# EAGLE design MCPv3ULN2803 (EAGLE 9.6.2)
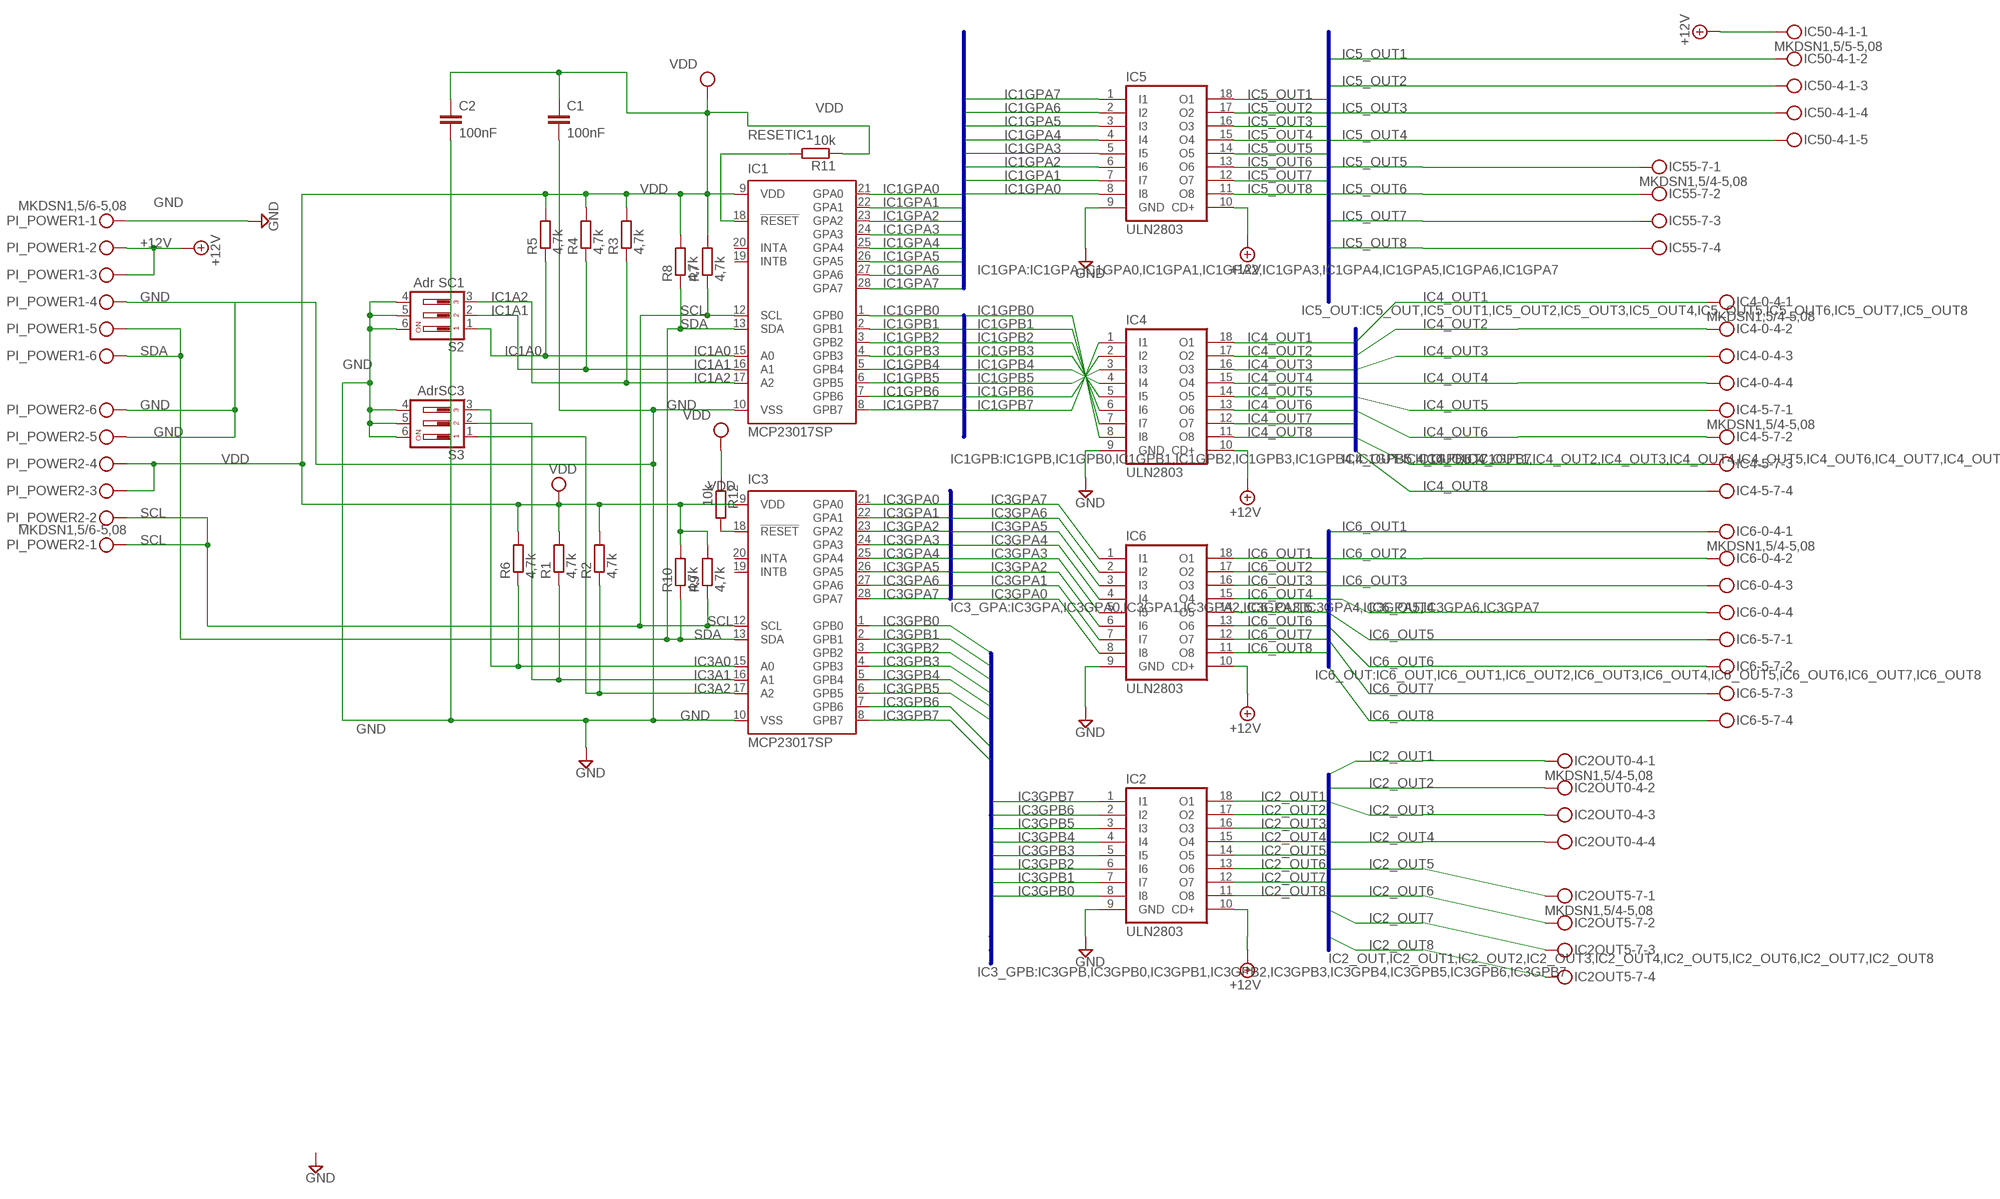
[diagram p0: schematic, sheet 1]

## Parts
C1  100nF  C-EU025_050-025X075  [C025_050-025X075]
C2  100nF  C-EU025_050-025X075  [C025_050-025X075]
IC1  MCP23017SP  [DIL28-3]
IC2  ULN2803  ULN2803A  [DIL18]
IC2OUT0-4  MKDSN1,5/4-5,08  [MKDSN1,5/4-5,08]
IC2OUT5-7  MKDSN1,5/4-5,08  [MKDSN1,5/4-5,08]
IC3  MCP23017SP  [DIL28-3]
IC4  ULN2803  ULN2803A  [DIL18]
IC4-0-4  MKDSN1,5/4-5,08  [MKDSN1,5/4-5,08]
IC4-5-7  MKDSN1,5/4-5,08  [MKDSN1,5/4-5,08]
IC5  ULN2803  ULN2803A  [DIL18]
IC6  ULN2803  ULN2803A  [DIL18]
IC6-0-4  MKDSN1,5/4-5,08  [MKDSN1,5/4-5,08]
IC6-5-7  MKDSN1,5/4-5,08  [MKDSN1,5/4-5,08]
IC50-4-1  MKDSN1,5/5-5,08  [MKDSN1,5/5-5,08]
IC55-7  MKDSN1,5/4-5,08  [MKDSN1,5/4-5,08]
PI_POWER1  MKDSN1,5/6-5,08  [MKDSN1,5/6-5,08]
PI_POWER2  MKDSN1,5/6-5,08  [MKDSN1,5/6-5,08]
R1  4,7k  R-EU_0204/7  [0204/7]
R2  4,7k  R-EU_0204/7  [0204/7]
R3  4,7k  R-EU_0204/7  [0204/7]
R4  4,7k  R-EU_0204/7  [0204/7]
R5  4,7k  R-EU_0204/7  [0204/7]
R6  4,7k  R-EU_0204/7  [0204/7]
R7  4,7k  R-EU_0204/7  [0204/7]
R8  4,7k  R-EU_0204/7  [0204/7]
R9  4,7k  R-EU_0204/7  [0204/7]
R10  4,7k  R-EU_0204/7  [0204/7]
R11  10k  R-EU_0204/7  [0204/7]
R12  10k  R-EU_0204/7  [0204/7]
S2  Adr SC1  DIP03YL  [DIP03YL]
S3  AdrSC3  DIP03YL  [DIP03YL]

## Nets
+12V: IC2.10(CD+) IC4.10(CD+) IC5.10(CD+) IC6.10(CD+) IC50-4-1.1 PI_POWER1.2 PI_POWER1.3
GND: C1.2 C2.2 IC1.10(VSS) IC2.9(GND) IC3.10(VSS) IC4.9(GND) IC5.9(GND) IC6.9(GND) PI_POWER1.1 PI_POWER1.4 PI_POWER2.5 PI_POWER2.6 S2.4 S2.5 S2.6 S3.4 S3.5 S3.6
IC1A0: IC1.15(A0) R5.1 S2.1
IC1A1: IC1.16(A1) R4.1 S2.2
IC1A2: IC1.17(A2) R3.1 S2.3
IC1GPA0: IC1.21(GPA0) IC5.8(I8)
IC1GPA1: IC1.22(GPA1) IC5.7(I7)
IC1GPA2: IC1.23(GPA2) IC5.6(I6)
IC1GPA3: IC1.24(GPA3) IC5.5(I5)
IC1GPA4: IC1.25(GPA4) IC5.4(I4)
IC1GPA5: IC1.26(GPA5) IC5.3(I3)
IC1GPA6: IC1.27(GPA6) IC5.2(I2)
IC1GPA7: IC1.28(GPA7) IC5.1(I1)
IC1GPB0: IC1.1(GPB0) IC4.8(I8)
IC1GPB1: IC1.2(GPB1) IC4.7(I7)
IC1GPB2: IC1.3(GPB2) IC4.6(I6)
IC1GPB3: IC1.4(GPB3) IC4.5(I5)
IC1GPB4: IC1.5(GPB4) IC4.4(I4)
IC1GPB5: IC1.6(GPB5) IC4.3(I3)
IC1GPB6: IC1.7(GPB6) IC4.2(I2)
IC1GPB7: IC1.8(GPB7) IC4.1(I1)
IC2_OUT1: IC2.18(O1) IC2OUT0-4.1
IC2_OUT2: IC2.17(O2) IC2OUT0-4.2
IC2_OUT3: IC2.16(O3) IC2OUT0-4.3
IC2_OUT4: IC2.15(O4) IC2OUT0-4.4
IC2_OUT5: IC2.14(O5) IC2OUT5-7.1
IC2_OUT6: IC2.13(O6) IC2OUT5-7.2
IC2_OUT7: IC2.12(O7) IC2OUT5-7.3
IC2_OUT8: IC2.11(O8) IC2OUT5-7.4
IC3A0: IC3.15(A0) R6.1 S3.3
IC3A1: IC3.16(A1) R1.1 S3.2
IC3A2: IC3.17(A2) R2.1 S3.1
IC3GPA0: IC3.21(GPA0) IC6.8(I8)
IC3GPA1: IC3.22(GPA1) IC6.7(I7)
IC3GPA2: IC3.23(GPA2) IC6.6(I6)
IC3GPA3: IC3.24(GPA3) IC6.5(I5)
IC3GPA4: IC3.25(GPA4) IC6.4(I4)
IC3GPA5: IC3.26(GPA5) IC6.3(I3)
IC3GPA6: IC3.27(GPA6) IC6.2(I2)
IC3GPA7: IC3.28(GPA7) IC6.1(I1)
IC3GPB0: IC2.8(I8) IC3.1(GPB0)
IC3GPB1: IC2.7(I7) IC3.2(GPB1)
IC3GPB2: IC2.6(I6) IC3.3(GPB2)
IC3GPB3: IC2.5(I5) IC3.4(GPB3)
IC3GPB4: IC2.4(I4) IC3.5(GPB4)
IC3GPB5: IC2.3(I3) IC3.6(GPB5)
IC3GPB6: IC2.2(I2) IC3.7(GPB6)
IC3GPB7: IC2.1(I1) IC3.8(GPB7)
IC4_OUT1: IC4-0-4.1 IC4.18(O1)
IC4_OUT2: IC4-0-4.2 IC4.17(O2)
IC4_OUT3: IC4-0-4.3 IC4.16(O3)
IC4_OUT4: IC4-0-4.4 IC4.15(O4)
IC4_OUT5: IC4-5-7.1 IC4.14(O5)
IC4_OUT6: IC4-5-7.2 IC4.13(O6)
IC4_OUT7: IC4-5-7.3 IC4.12(O7)
IC4_OUT8: IC4-5-7.4 IC4.11(O8)
IC5_OUT1: IC5.18(O1) IC50-4-1.2
IC5_OUT2: IC5.17(O2) IC50-4-1.3
IC5_OUT3: IC5.16(O3) IC50-4-1.4
IC5_OUT4: IC5.15(O4) IC50-4-1.5
IC5_OUT5: IC5.14(O5) IC55-7.1
IC5_OUT6: IC5.13(O6) IC55-7.2
IC5_OUT7: IC5.12(O7) IC55-7.3
IC5_OUT8: IC5.11(O8) IC55-7.4
IC6_OUT1: IC6-0-4.1 IC6.18(O1)
IC6_OUT2: IC6-0-4.2 IC6.17(O2)
IC6_OUT3: IC6-0-4.3 IC6.16(O3)
IC6_OUT4: IC6-0-4.4 IC6.15(O4)
IC6_OUT5: IC6-5-7.1 IC6.14(O5)
IC6_OUT6: IC6-5-7.2 IC6.13(O6)
IC6_OUT7: IC6-5-7.3 IC6.12(O7)
IC6_OUT8: IC6-5-7.4 IC6.11(O8)
RESETIC1: IC1.18(!RESET) R11.2
RESETIC3: IC3.18(!RESET) R12.2
SCL: IC1.12(SCL) IC3.12(SCL) PI_POWER2.1 PI_POWER2.2 R7.1 R9.1
SDA: IC1.13(SDA) IC3.13(SDA) PI_POWER1.5 PI_POWER1.6 R8.1 R10.1
VDD: C1.1 C2.1 IC1.9(VDD) IC3.9(VDD) PI_POWER2.3 PI_POWER2.4 R1.2 R2.2 R3.2 R4.2 R5.2 R6.2 R7.2 R8.2 R9.2 R10.2 R11.1 R12.1
Unconnected: IC1.19(INTB) IC1.20(INTA) IC3.19(INTB) IC3.20(INTA)

## Buses
IC1GPA:IC1GPA,IC1GPA0,IC1GPA1,IC1GPA2,IC1GPA3,IC1GPA4,IC1GPA5,IC1GPA6,IC1GPA7
IC5_OUT:IC5_OUT,IC5_OUT1,IC5_OUT2,IC5_OUT3,IC5_OUT4,IC5_OUT5,IC5_OUT6,IC5_OUT7,IC5_OUT8
IC1GPB:IC1GPB,IC1GPB0,IC1GPB1,IC1GPB2,IC1GPB3,IC1GPB4,IC1GPB5,IC1GPB6,IC1GPB7
IC4_OUT:IC4_OUT,IC4_OUT1,IC4_OUT2,IC4_OUT3,IC4_OUT4,IC4_OUT5,IC4_OUT6,IC4_OUT7,IC4_OUT8
IC3_GPA:IC3GPA,IC3GPA0,IC3GPA1,IC3GPA2,IC3GPA3,IC3GPA4,IC3GPA5,IC3GPA6,IC3GPA7
IC6_OUT:IC6_OUT,IC6_OUT1,IC6_OUT2,IC6_OUT3,IC6_OUT4,IC6_OUT5,IC6_OUT6,IC6_OUT7,IC6_OUT8
IC3_GPB:IC3GPB,IC3GPB0,IC3GPB1,IC3GPB2,IC3GPB3,IC3GPB4,IC3GPB5,IC3GPB6,IC3GPB7
IC2_OUT,IC2_OUT1,IC2_OUT2,IC2_OUT3,IC2_OUT4,IC2_OUT5,IC2_OUT6,IC2_OUT7,IC2_OUT8

## Library data of the parts
C1 C2 = resistor:C-EU: CAPACITOR, European symbol
IC1 IC3 = microchip:MCP23017: http://ww1.microchip.com/downloads/en/DeviceDoc/21952a.pdf Source: http://ww1.microchip.com/downloads/en/DeviceDoc/21952a.pdf; MF: MICROCHIP; MPN: MCP23017-E/SP; OC_FARNELL: 1332088; OC_NEWARK: 31K2959
IC2 IC4-IC6 = uln-udn:ULN2803A: DRIVER ARRAY
IC2OUT0-4 IC2OUT5-7 IC4-0-4 IC4-5-7 IC6-0-4 IC6-5-7 IC55-7 = con-phoenix-508:MKDSN1,5/4-5,08: MKDSN 1,5/ 4-5,08 Printklemme Nennstrom: 13,5 A Nennspannung: 250 V Rastermaß: 5,08 mm Polzahl: 4 Anschlussart: Schraubanschluss Montage: Löten Anschlussrichtung Leiter/Platine: 0 ° Artikelnummer: 1729144 Source: http://eshop.phoenixcontact.com .. 1729144.pdf
IC50-4-1 = con-phoenix-508:MKDSN1,5/5-5,08: MKDSN 1,5/ 5-5,08 Printklemme Nennstrom: 13,5 A Nennspannung: 250 V Rastermaß: 5,08 mm Polzahl: 5 Anschlussart: Schraubanschluss Montage: Löten Anschlussrichtung Leiter/Platine: 0 ° Artikelnummer: 1729157 Source: http://eshop.phoenixcontact.com .. 1729157.pdf
PI_POWER1 PI_POWER2 = con-phoenix-508:MKDSN1,5/6-5,08: MKDSN 1,5/ 6-5,08 Printklemme Nennstrom: 13,5 A Nennspannung: 250 V Rastermaß: 5,08 mm Polzahl: 6 Anschlussart: Schraubanschluss Montage: Löten Anschlussrichtung Leiter/Platine: 0 ° Artikelnummer: 1729160 Source: http://eshop.phoenixcontact.com .. 1729160.pdf
R1-R12 = resistor:R-EU_: RESISTOR, European symbol
S2 S3 = switch-dil:DIP03YL: DIL/CODE SWITCH; OC_FARNELL: unknown; OC_NEWARK: unknown

## Board
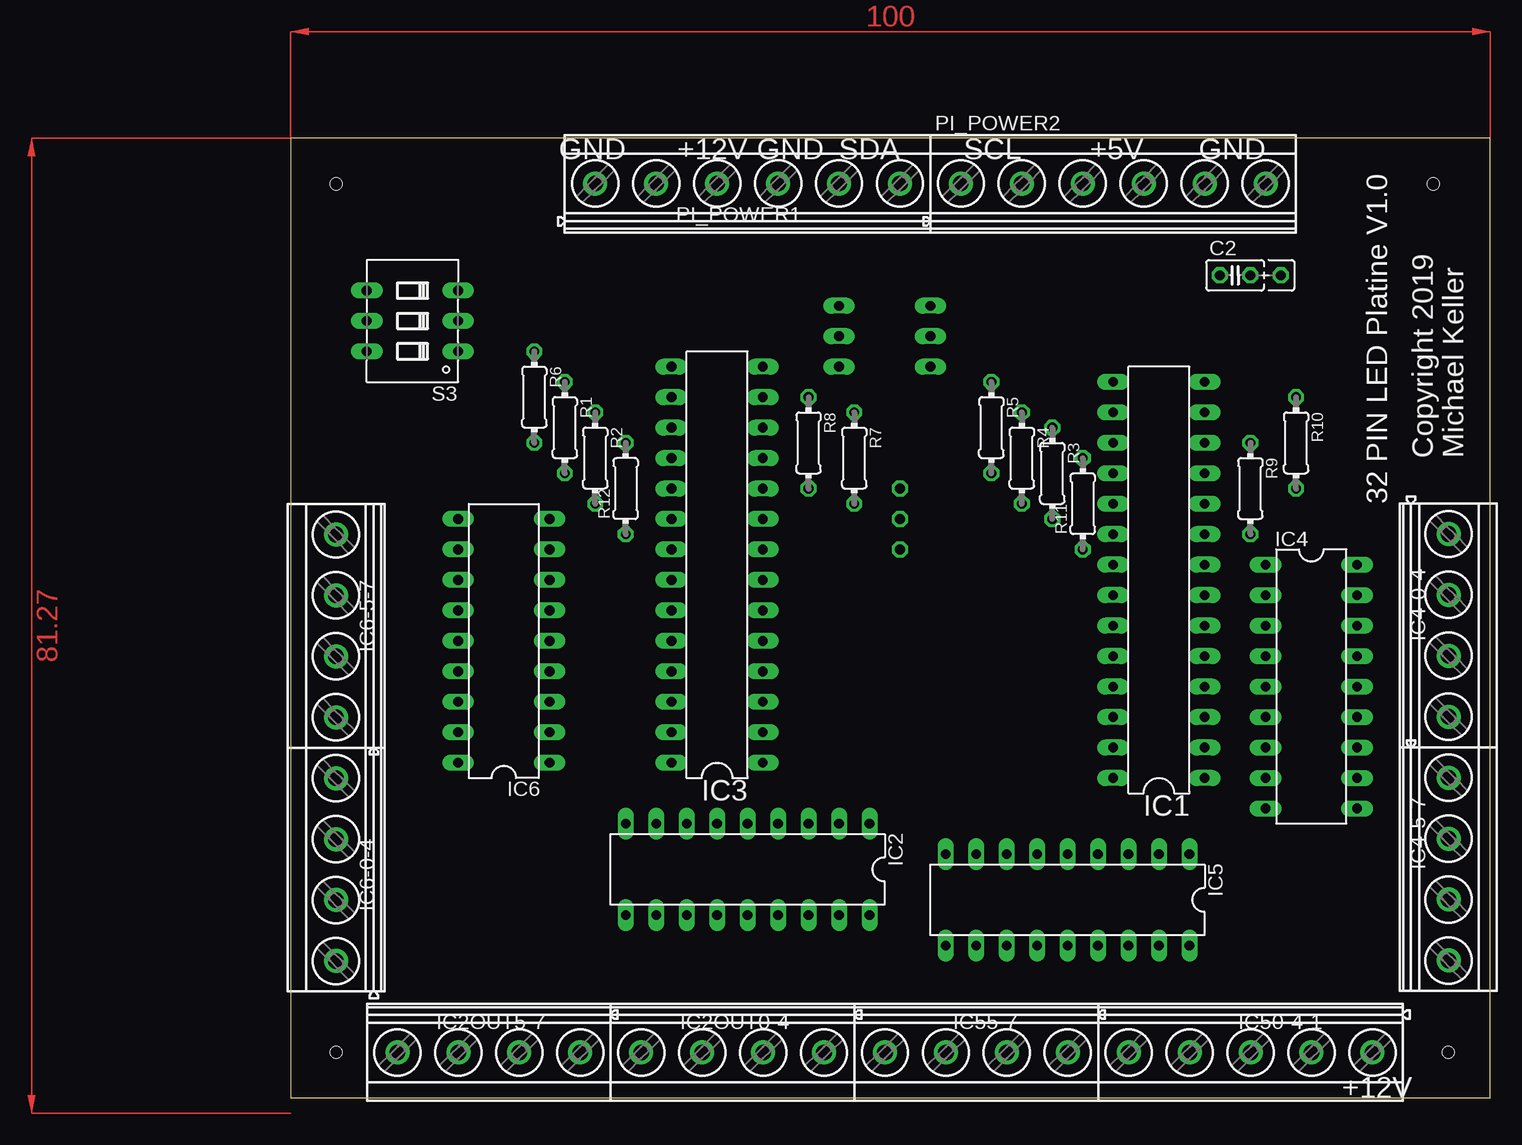
[diagram p1: board, top side]
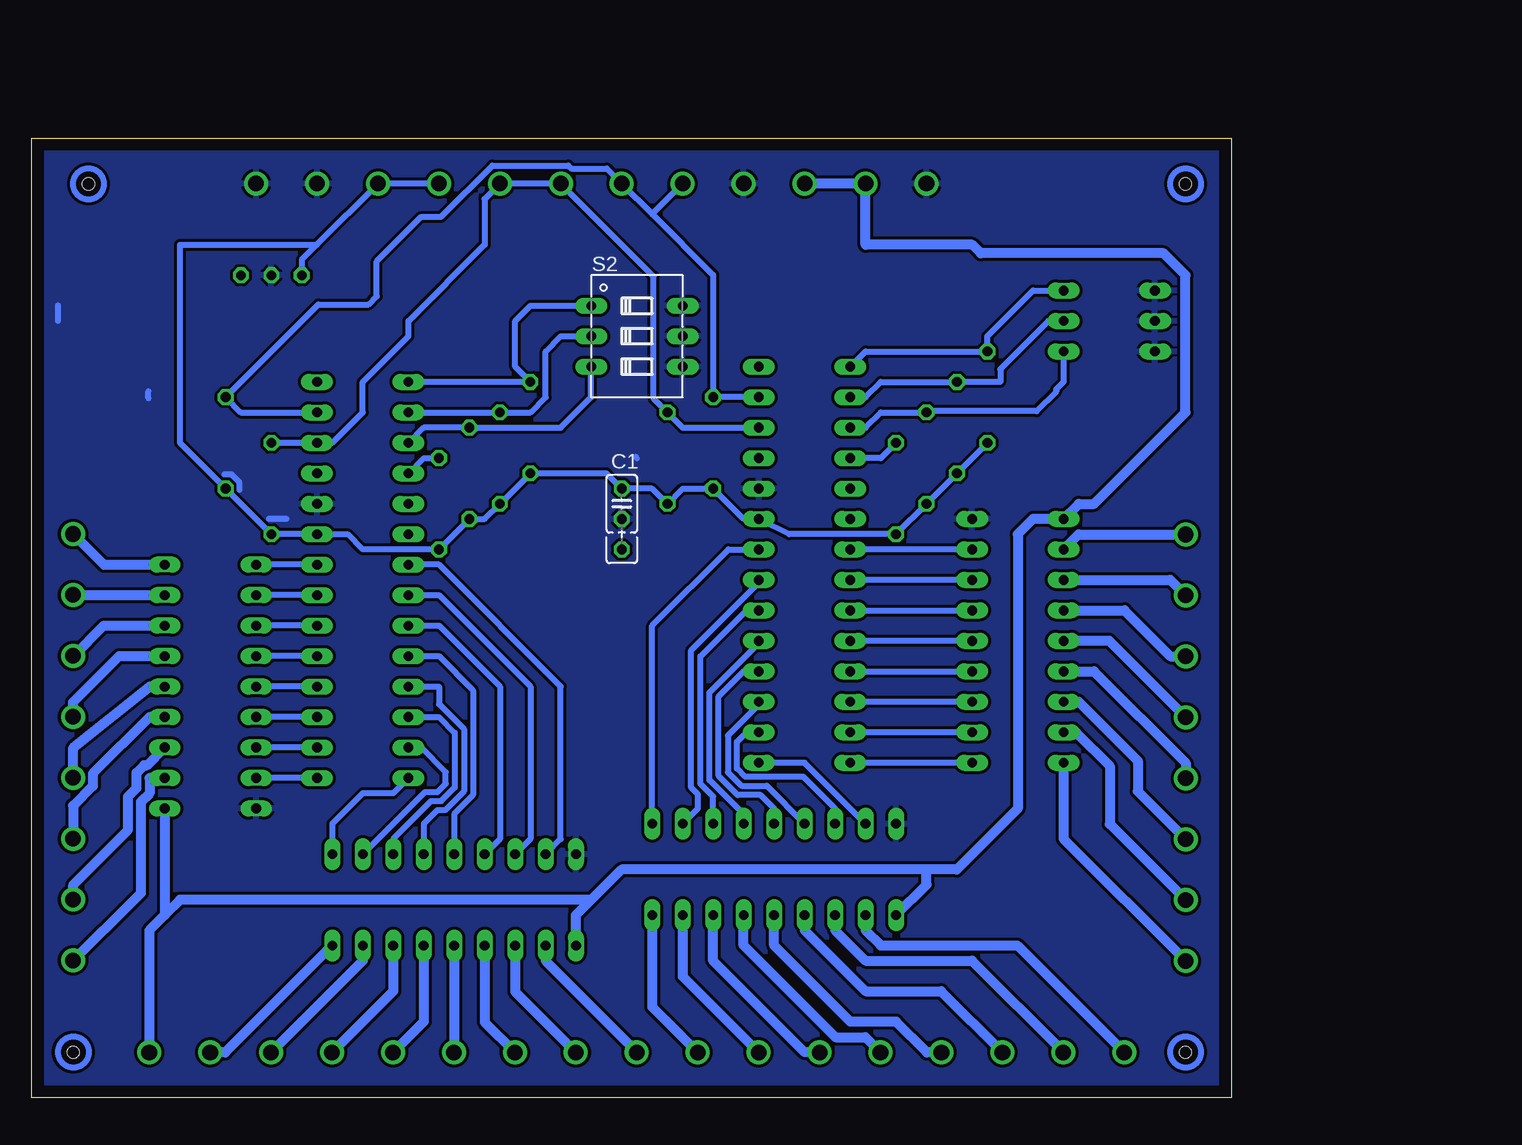
[diagram p2: board, bottom side, seen from below]

Size 100 x 80 mm. Coordinates in mm from the lower left corner, seen from the top.
Outline: 0,0 100,0 100,80 0,80 0,0
Copper layers (1*16): Top 0.035mm / dielectric 1.5mm / Bottom 0.035mm
Design rules "platinenbelichter": minimum track width 10mil, minimum drill 24mil, track to track 10mil, track to pad 10mil, pad to pad 10mil, via to via 10mil, smd to smd 10mil, copper to edge 40mil, drill to drill 8mil, minimum pad ring 10mil, minimum via ring 8mil, stop-mask expansion 10mil, vias tented up to drill 0mil, thermal gap 10mil
Holes 1 mm at 3.81,76.2 95.25,76.2 96.52,3.81 3.81,3.81

### Footprints (pad centres in the part's own frame; a part is rotated, then mirrored left to right if it is on the bottom)
C025_050-025X075 = drill 0.813 octagon: 1 -1.27,0; 2 1.27,0; 3 3.81,0
DIL28-3 = drill 0.813 long: 1 -16.51,-3.81; 2 -13.97,-3.81; 3 -11.43,-3.81; 4 -8.89,-3.81; 5 -6.35,-3.81; 6 -3.81,-3.81; 7 -1.27,-3.81; 8 1.27,-3.81; 9 3.81,-3.81; 10 6.35,-3.81; 11 8.89,-3.81; 12 11.43,-3.81; 13 13.97,-3.81; 14 16.51,-3.81; 15 16.51,3.81; 16 13.97,3.81; 17 11.43,3.81; 18 8.89,3.81; 19 6.35,3.81; 20 3.81,3.81; 21 1.27,3.81; 22 -1.27,3.81; 23 -3.81,3.81; 24 -6.35,3.81; 25 -8.89,3.81; 26 -11.43,3.81; 27 -13.97,3.81; 28 -16.51,3.81
DIL18 = drill 0.813 long: 1 -10.16,-3.81; 2 -7.62,-3.81; 3 -5.08,-3.81; 4 -2.54,-3.81; 5 0,-3.81; 6 2.54,-3.81; 7 5.08,-3.81; 8 7.62,-3.81; 9 10.16,-3.81; 10 10.16,3.81; 11 7.62,3.81; 12 5.08,3.81; 13 2.54,3.81; 14 0,3.81; 15 -2.54,3.81; 16 -5.08,3.81; 17 -7.62,3.81; 18 -10.16,3.81
MKDSN1,5/4-5,08 = drill 1.3 pad 2: 1 -7.641,0.025; 2 -2.561,0.025; 3 2.519,0.025; 4 7.599,0.025
MKDSN1,5/5-5,08 = drill 1.3 pad 2: 1 -10.181,0.025; 2 -5.101,0.025; 3 -0.021,0.025; 4 5.059,0.025; 5 10.139,0.025
MKDSN1,5/6-5,08 = drill 1.3 pad 2: 1 -12.7,0.025; 2 -7.62,0.025; 3 -2.54,0.025; 4 2.54,0.025; 5 7.62,0.025; 6 12.7,0.025
0204/7 = drill 0.813 octagon: 1 -3.81,0; 2 3.81,0
DIP03YL = drill 0.813 long: 1 -2.54,-3.81; 2 0,-3.81; 3 2.54,-3.81; 4 2.54,3.81; 5 0,3.81; 6 -2.54,3.81

### Placement (x,y rotation side)
C1  50.8,49.53 270 bottom
C2  78.74,68.58 0 top
DRILEGEND  [DRILEGEND]  -24.72,-6.27 0 top  (outside the outline)
IC1  72.39,43.18 90 top
IC2  38.1,19.05 180 top
IC2OUT0-4  36.83,3.81 180 top
IC2OUT5-7  16.51,3.81 180 top
IC3  35.56,44.45 90 top
IC4  85.09,34.29 270 top
IC4-0-4  96.52,39.37 270 top
IC4-5-7  96.52,19.05 270 top
IC5  64.77,16.51 180 top
IC6  17.78,38.1 90 top
IC6-0-4  3.81,19.05 90 top
IC6-5-7  3.81,39.37 90 top
IC50-4-1  80.01,3.81 180 top
IC55-7  57.15,3.81 180 top
PI_POWER1  38.1,76.2 0 top
PI_POWER2  68.58,76.2 0 top
R1  22.86,55.88 270 top
R2  25.4,53.34 270 top
R3  63.5,52.07 270 top
R4  60.96,53.34 270 top
R5  58.42,55.88 270 top
R6  20.32,58.42 270 top
R7  46.99,53.34 270 top
R8  43.18,54.61 270 top
R9  80.01,50.8 270 top
R10  83.82,54.61 270 top
R11  66.04,49.53 90 top
R12  27.94,50.8 90 top
S2  49.53,63.5 270 bottom
S3  10.16,64.77 90 top

### Tracks (layer width: path | path; a pad name or v marks a point on that pad's centre or on a via)
+12V
  Bottom 0.813: 53.34,16.51 54.61,15.24 IC5.10 | 53.34,16.51 50.8,19.05 25.4,19.05 | 25.4,19.05 22.86,19.05 17.78,24.13 17.78,46.99 16.51,48.26 IC6.10 12.7,49.53 11.43,49.53 3.81,57.15 3.81,68.58 5.64,70.41 20.87,70.41 21.58,71.12 30.48,71.12 PI_POWER1.2 PI_POWER1.3 | 53.34,16.51 87.63,16.51 88.9,15.24 | 25.4,19.05 25.4,17.78 IC2.10 | IC50-4-1.1 90.19,13.95 88.9,15.24 | IC4.10 88.9,15.24
GND
  Bottom 0.508: 78.74,48.26 80.2,48.26 | 82.65,50.71 82.65,51.28 83.34,51.97 83.91,51.97 | 97.79,64.77 97.79,66.06 | 49.53,53.34 49.63,53.44 | 90.27,58.33 90.27,58.9
  pour Bottom: 0,80.01 100.33,80.01 100.33,0 0,0
IC1A0
  Bottom 0.508: S2.1 58.42,66.04 59.69,64.77 59.69,60.96 R5.1 IC1.15
IC1A1
  Bottom 0.508: IC1.16 R4.1 58.42,57.15 57.15,58.42 57.15,62.23 55.88,63.5 S2.2
IC1A2
  Bottom 0.508: IC1.17 67.31,55.88 R3.1 55.88,55.88 53.34,58.42 S2.3
IC1GPA0
  Bottom 0.508: IC5.8 55.88,21.59 55.88,34.29 66.04,44.45 IC1.21
IC1GPA1
  Bottom 0.508: IC1.22 66.04,41.91 58.42,34.29 58.42,21.59 IC5.7
IC1GPA2
  Bottom 0.508: IC1.23 66.04,39.37 60.96,34.29 60.96,21.59 IC5.6
IC1GPA3
  Bottom 0.508: IC1.24 66.04,36.83 63.2,33.98 63.2,25.24 64.77,23.66 IC5.5
IC1GPA4
  Bottom 0.508: IC1.25 66.04,34.29 66.04,32.83 63.96,30.75 63.96,25.55 65.53,23.98 66.19,23.98 67.31,22.86 IC5.4
IC1GPA5
  Bottom 0.508: IC5.3 69.85,21.59 66.7,24.74 65.85,24.74 64.72,25.87 64.72,30.43 66.04,31.75 IC1.26
IC1GPA6
  Bottom 0.508: IC1.27 67.54,29.21 65.48,27.15 65.48,26.19 66.17,25.5 67.21,25.5 IC5.2
IC1GPA7
  Bottom 0.508: IC1.28 69.85,25.4 72.39,25.4 74.93,22.86 IC5.1
IC1GPB0
  Bottom 0.508: IC1.1 IC4.8
IC1GPB1
  Bottom 0.508: IC1.2 IC4.7
IC1GPB2
  Bottom 0.508: IC1.3 IC4.6
IC1GPB3
  Bottom 0.508: IC1.4 IC4.5
IC1GPB4
  Bottom 0.508: IC1.5 IC4.4
IC1GPB5
  Bottom 0.508: IC1.6 IC4.3
IC1GPB6
  Bottom 0.508: IC1.7 IC4.2
IC1GPB7
  Bottom 0.508: IC1.8 IC4.1
IC2_OUT1
  Bottom 0.813: IC2.18 48.26,7.57 IC2OUT0-4.1
IC2_OUT2
  Bottom 0.813: IC2.17 45.72,10.11 IC2OUT0-4.2
IC2_OUT3
  Bottom 0.813: IC2OUT0-4.3 34.34,3.81 35.56,3.81 43.18,11.43 IC2.16
IC2_OUT4
  Bottom 0.813: IC2OUT0-4.4 30.5,5.05 32.99,5.05 40.64,12.7 IC2.15
IC2_OUT5
  Bottom 0.813: IC2OUT5-7.1 25.38,3.79 27.94,6.35 31.75,6.35 38.1,12.7 IC2.14
IC2_OUT6
  Bottom 0.813: IC2.13 35.56,13.97 30.48,8.89 24.18,8.89 IC2OUT5-7.2
IC2_OUT7
  Bottom 0.813: IC2.12 33.02,13.97 30.48,11.43 21.59,11.43 13.99,3.83 IC2OUT5-7.3
IC2_OUT8
  Bottom 0.813: IC2.11 30.48,13.97 29.21,12.7 17.83,12.7 IC2OUT5-7.4
IC3A0
  Bottom 0.508: IC3.15 30.48,62.23 R6.1 20.32,63.5 16.51,67.31 S3.3
IC3A1
  Bottom 0.508: IC3.16 30.48,58.42 29.21,59.69 R1.1 19.25,59.69 19.25,60.76 15.24,64.77 15.21,64.77 15.11,64.87 14.7,64.87 14.51,64.93 14.4,64.87 14.26,64.87 14.16,64.77 S3.2
IC3A2
  Bottom 0.508: IC3.17 30.48,55.88 29.21,57.15 R2.1 25.3,57.25 16.22,57.25 14.58,58.89 14.58,59.08 13.97,59.69 S3.1
IC3GPA0
  Bottom 0.508: IC6.8 IC3.21
IC3GPA1
  Bottom 0.508: IC6.7 IC3.22
IC3GPA2
  Bottom 0.508: IC3.23 IC6.6
IC3GPA3
  Bottom 0.508: IC6.5 IC3.24
IC3GPA4
  Bottom 0.508: IC3.25 IC6.4
IC3GPA5
  Bottom 0.508: IC6.3 IC3.26
IC3GPA6
  Bottom 0.508: IC6.2 IC3.27
IC3GPA7
  Bottom 0.508: IC6.1 IC3.28
IC3GPB0
  Bottom 0.508: IC2.8 35.56,27.94 IC3.1
IC3GPB1
  Bottom 0.508: IC2.7 33.02,24.13 35.66,26.77 40.51,26.77 41.2,27.46 41.2,29.69 40.41,30.48 IC3.2
IC3GPB2
  Bottom 0.508: IC3.3 39.37,32.79 41.96,30.2 41.96,27.14 40.83,26.01 38.71,26.01 IC2.6
IC3GPB3
  Bottom 0.508: IC3.4 40.64,35.56 42.72,33.48 42.72,26.82 41.15,25.25 39.22,25.25 38.1,24.13 IC2.5
IC3GPB4
  Bottom 0.508: IC2.4 40.64,23.66 43.48,26.51 43.48,33.79 39.37,37.91 IC3.5
IC3GPB5
  Bottom 0.508: IC2.3 43.18,25.13 44.25,26.19 44.25,36.81 40.41,40.64 IC3.6
IC3GPB6
  Bottom 0.508: IC2.2 44.45,24.13 44.45,25.32 45.01,25.88 45.01,37.31 39.37,42.95 IC3.7
IC3GPB7
  Bottom 0.508: IC2.1 48.26,39.37 41.91,45.72 IC3.8
IC4_OUT1
  Bottom 0.813: IC4-0-4.1 93.98,44.45 IC4.18
IC4_OUT2
  Bottom 0.813: IC4-0-4.2 88.92,41.93 IC4.17
IC4_OUT3
  Bottom 0.813: IC4-0-4.3 96.5,36.85 93.98,39.37 IC4.16
IC4_OUT4
  Bottom 0.813: IC4-0-4.4 96.55,32.99 92.71,36.83 IC4.15
IC4_OUT5
  Bottom 0.813: IC4.14 90.17,34.29 96.52,29.21 IC4-5-7.1
IC4_OUT6
  Bottom 0.813: IC4.13 90.17,31.75 94.89,27.04 94.89,26 96.55,24.34 IC4-5-7.2
IC4_OUT7
  Bottom 0.813: IC4-5-7.3 96.52,17.78 91.95,22.35 91.95,25.12 91.24,25.83 91.24,27.11 90.61,27.74 90.37,27.74 IC4.12
IC4_OUT8
  Bottom 0.813: IC4.11 90.17,26.67 90.17,25.39 90.88,24.68 90.88,17.07 91.44,16.51 IC4-5-7.4
IC5_OUT1
  Bottom 0.813: IC5.18 83.84,3.79 IC50-4-1.2
IC5_OUT2
  Bottom 0.813: IC5.17 72.39,11.43 IC50-4-1.3
IC5_OUT3
  Bottom 0.813: IC5.16 69.85,8.89 IC50-4-1.4
IC5_OUT4
  Bottom 0.813: IC5.15 67.31,6.35 IC50-4-1.5
IC5_OUT5
  Bottom 0.813: IC5.14 64.77,3.81 IC55-7.1
IC5_OUT6
  Bottom 0.813: IC55-7.2 62.23,6.3 IC5.13
IC5_OUT7
  Bottom 0.813: IC55-7.3 59.69,8.84 IC5.12
IC5_OUT8
  Bottom 0.813: IC5.11 57.15,11.43 49.55,3.83 IC55-7.4
IC6_OUT1
  Bottom 0.813: IC6.18 13.97,21.59 IC6-0-4.1
IC6_OUT2
  Bottom 0.813: IC6-0-4.2 10.12,22.82 10.12,27.66 12.94,30.48 IC6.17
IC6_OUT3
  Bottom 0.813: IC6.16 12.7,33.02 7.78,28.1 7.78,25.57 IC6-0-4.3
IC6_OUT4
  Bottom 0.813: IC6.15 11.43,35.56 3.79,27.91 IC6-0-4.4
IC6_OUT5
  Bottom 0.813: IC6.14 10.16,38.1 IC6-5-7.1
IC6_OUT6
  Bottom 0.813: IC6.13 8.89,40.64 5.06,36.81 IC6-5-7.2
IC6_OUT7
  Bottom 0.813: IC6-5-7.3 5.08,43.18 IC6.12
IC6_OUT8
  Bottom 0.813: IC6.11 12.72,46.97 IC6-5-7.4
RESETIC1
  Bottom 0.508: IC1.18 67.31,53.34 R11.2
RESETIC3
  Bottom 0.508: R12.2 29.21,53.34 IC3.18
SCL
  Bottom 0.508: R9.1 IC1.12 74.93,54.61 72.39,57.15 72.39,59.69 68.58,63.5 68.58,64.77 62.23,71.12 62.24,71.13 62.24,74.94 PI_POWER2.2 PI_POWER2.1 48.13,68.48 48.13,58.29 R7.1 45.72,55.88 IC3.12
SDA
  Bottom 0.508: IC3.13 R8.1 43.18,68.61 48.25,73.67 | 48.25,73.67 PI_POWER1.6 52.05,77.47 54.99,77.47 55.26,77.73 61.59,77.73 65.87,73.45 67.52,73.45 71.22,69.75 71.22,66.83 71.91,66.14 76.1,66.14 R10.1 82.55,57.15 IC1.13 | PI_POWER1.5 48.25,73.7 48.25,73.67
VDD
  Bottom 0.508: R6.2 R1.2 R2.2 R12.1 36.83,46.99 IC3.9 40.64,48.26 R8.2 45.72,50.8 R7.2 48.26,50.8 C1.1 52.07,52.07 R5.2 R4.2 62.23,48.26 R3.2 R11.1 72.39,45.72 73.66,46.99 IC1.9 R9.2 R10.2 87.63,54.61 87.63,71.12 76.22,71.12 | PI_POWER2.3 PI_POWER2.4 76.22,71.12 | 76.22,71.12 77.47,69.88 C2.1
(copper drawn outside any net)
  shapes: Bottom circle x5, Top area x2

### Text on the board
_tNames: GND | +12V | GND | SDA | SCL | +5V | GND | Copyright 2019 | Michael Keller | 32 PIN LED Platine V1.0 | +12V